# EAGLE design ColorSense (EAGLE 6.2)
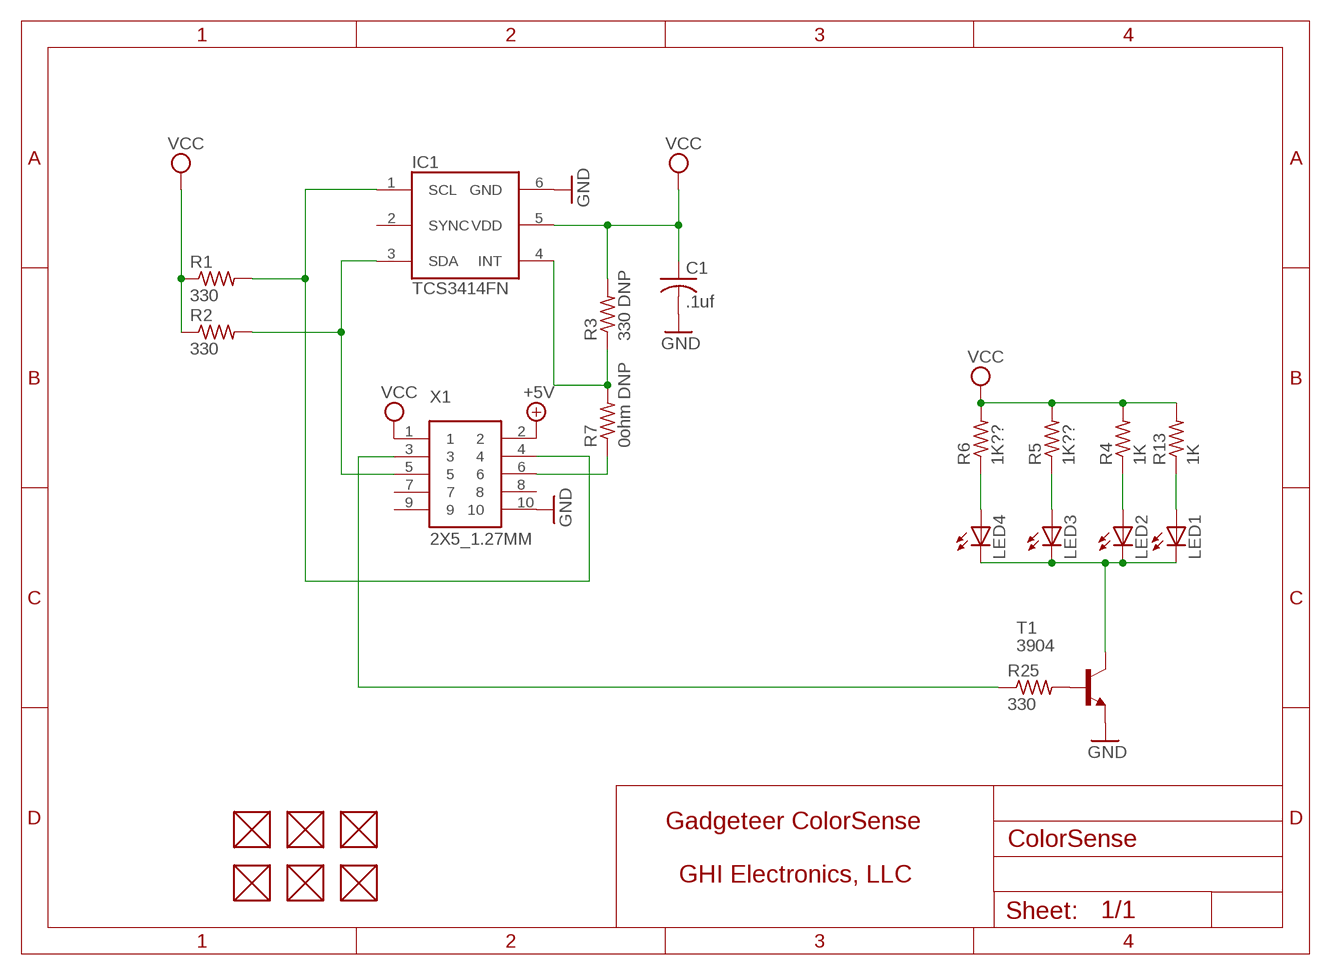
[diagram p0: schematic, sheet 1]

## Parts
C1  .1uf  C-USC0603K  [C0603K]
FUD1  FIDUCIAL  [FIDUCIAL_40MIL]
FUD2  FIDUCIAL  [FIDUCIAL_40MIL]
FUD3  FIDUCIAL  [FIDUCIAL_40MIL]
FUD4  FIDUCIAL  [FIDUCIAL_40MIL]
FUD5  FIDUCIAL  [FIDUCIAL_40MIL]
FUD6  FIDUCIAL  [FIDUCIAL_40MIL]
IC1  TCS3414FN  [DFN-6]
LED1  LEDCHIPLED_0805  [CHIPLED_0805]
LED2  LEDCHIPLED_0805  [CHIPLED_0805]
LED3  LEDCHIPLED_0805  [CHIPLED_0805]
LED4  LEDCHIPLED_0805  [CHIPLED_0805]
R1  330  R-US_R0603  [R0603]
R2  330  R-US_R0603  [R0603]
R3  330 DNP  R-US_R0603  [R0603]
R4  1K  R-US_R0603  [R0603]
R5  1K??  R-US_R0603  [R0603]
R6  1K??  R-US_R0603  [R0603]
R7  0ohm DNP  R-US_R0603  [R0603]
R13  1K  R-US_R0603  [R0603]
R25  330  R-US_R0603  [R0603]
T1  3904  BC847-NPN-SOT23-BEC  [SOT23-BEC]
X1  2X5_1.27MM  [2X5_1.27MM]

## Nets
+5V [power]: X1.2
BACKLIGHT: R25.1 X1.3
GND [power]: C1.2 IC1.6(GND) T1.E X1.10
LED-: LED1.C LED2.C LED3.C LED4.C T1.C
N$1: IC1.4(INT) R3.1 R7.2
N$2: IC1.3(SDA) R2.2 X1.5
N$3: IC1.1(SCL) R1.2 X1.4
N$4: R7.1 X1.6
N$5: LED2.A R4.1
N$6: LED3.A R5.1
N$7: LED4.A R6.1
N$10: LED1.A R13.1
N$23: R25.2 T1.B
VCC [power]: C1.1 IC1.5(VDD) R1.1 R2.1 R3.2 R4.2 R5.2 R6.2 R13.2 X1.1
Unconnected: FUD1.P$1 FUD2.P$1 FUD3.P$1 FUD4.P$1 FUD5.P$1 FUD6.P$1 IC1.2(SYNC) X1.7 X1.8 X1.9

## Notes on the sheet
- Gadgeteer ColorSense
- GHI Electronics, LLC

## Library data of the parts
C1 = rcl:C-US: CAPACITOR, American symbol
FUD1-FUD6 = GHI:FIDUCIAL
IC1 = GHI2:TCS3414FN
LED1-LED4 = led:LED: LED OSRAM: - CHIPLED LG R971, LG N971, LY N971, LG Q971, LY Q971, LO R971, LY R971 LH N974, LH R974 LS Q976, LO Q976, LY Q976 LO Q996 - Hyper CHIPLED LW Q18S LB Q993, LB Q99A, LB R99A - SideLED LS A670, LO A670, LY A670, LG A670, LP A670 LB A673, LV A673, LT A673, LW A673 LH A674 LY A675 LS A676, LA A676, LO A676, LY A676, LW A676 LS A679, LY A679, LG A679 - Hyper Micro SIDELED® LS Y876, LA Y876, LO Y876, LY Y876 LT Y87S - SmartLED LW L88C, LW L88S LB L89C, LB L89S, LG L890 LS L89K, LO L89K, LY L89K LS L896, LA L896, LO L896, LY L896 - TOPLED LS T670, LO T670, LY T670, LG T670, LP T670 LSG T670, LSP T670, LSY T670, LOP T670, LYG T670 LG T671, LOG T671, LSG T671 LB T673, LV T673, LT T673, LW T673 LH T674 LS T676, LA T676, LO T676, LY T676, LB T676, LH T676, LSB T676, LW T676 LB T67C, LV T67C, LT T67C, LS T67K, LO T67K, LY T67K, LW E67C LS E67B, LA E67B, LO E67B, LY E67B, LB E67C, LV E67C, LT E67C LW T67C LS T679, LY T679, LG T679 LS T770, LO T770, LY T770, LG T770, LP T770 LB T773, LV T773, LT T773, LW T773 LH T774 LS E675, LA E675, LY E675, LS T675 LS T776, LA T776, LO T776, LY T776, LB T776 LHGB T686 LT T68C, LB T68C - Hyper Mini TOPLED® LB M676 - Mini TOPLED Santana® LG M470 LS M47K, LO M47K, LY M47K Source: http://www.osram.convergy.de LUXEON: - LUMILED® LXK2-PW12-R00, LXK2-PW12-S00, LXK2-PW14-U00, LXK2-PW14-V00 LXK2-PM12-R00, LXK2-PM12-S00, LXK2-PM14-U00 LXK2-PE12-Q00, LXK2-PE12-R00, LXK2-PE12-S00, LXK2-PE14-T00, LXK2-PE14-U00 LXK2-PB12-K00, LXK2-PB12-L00, LXK2-PB12-M00, LXK2-PB14-N00, LXK2-PB14-P00, LXK2-PB14-Q00 LXK2-PR12-L00, LXK2-PR12-M00, LXK2-PR14-Q00, LXK2-PR14-R00 LXK2-PD12-Q00, LXK2-PD12-R00, LXK2-PD12-S00 LXK2-PH12-R00, LXK2-PH12-S00 LXK2-PL12-P00, LXK2-PL12-Q00, LXK2-PL12-R00 Source: www.luxeon.com KINGBRIGHT: KA-3528ASYC Source: www.kingbright.com
R1-R7 R13 R25 = rcl:R-US_: RESISTOR, American symbol
T1 = transistor:*-NPN-: NPN Transistror BF959 corrected 2008.03.06
X1 = GHI:2X5_1.27MM

## Board
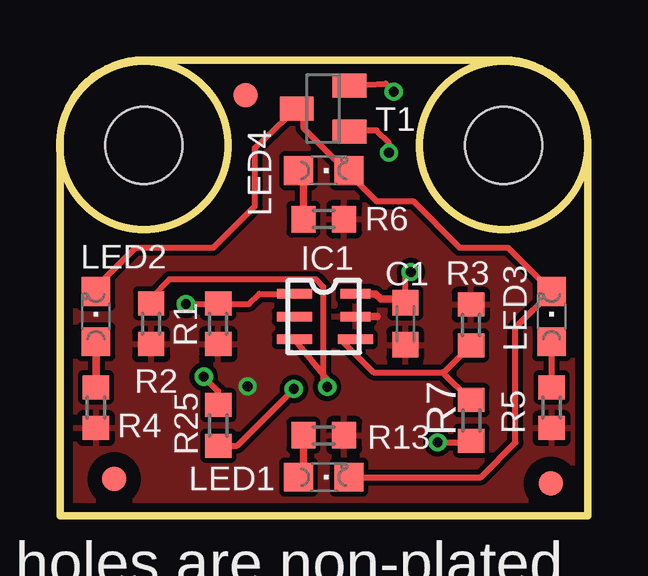
[diagram p1: board, top side]
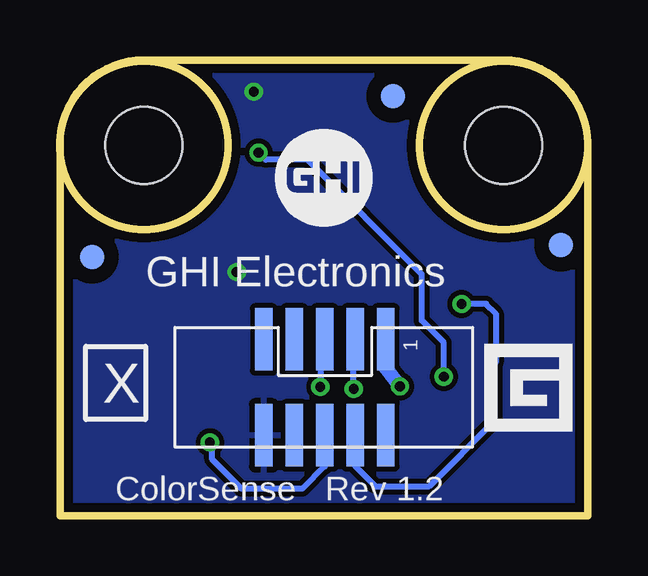
[diagram p2: board, bottom side, seen from below]

Size 22 x 19 mm. Coordinates in mm from the lower left corner, seen from the top.
Outline: 0,0 22,0 22,15.5 arc90 18.5,19 3.5,19 arc90 0,15.5 0,0
Outline: circle at 3.5,15.44 radius 3.5
Outline: circle at 18.5,15.44 radius 3.5
Copper layers (1+16): Top 0.035mm / dielectric 1.5mm / Bottom 0.035mm
Design rules: minimum track width 8mil, minimum drill 12mil, track to track 8mil, track to pad 8mil, pad to pad 8mil, via to via 8mil, smd to smd 8mil, copper to edge 15mil, drill to drill 8mil, minimum pad ring 10mil, minimum via ring 7mil, stop-mask expansion 4mil, vias tented up to drill 50mil, thermal gap 10mil
Holes 3.2 mm at 18.5,15.44 3.5,15.44

### Footprints (pad centres in the part's own frame; a part is rotated, then mirrored left to right if it is on the bottom)
C0603K = smd 1.05 x 1.08: 1 -0.875,0; 2 0.875,0
FIDUCIAL_40MIL = smd 1.016 x 1.016: P$1 0,0
DFN-6 = smd 1.45 x 0.4: 1 -1.225,0.95; 2 -1.225,0; 3 -1.225,-0.95; 4 1.325,-0.95 | smd 1.25 x 0.4: 5 1.325,0; 6 1.325,0.95
CHIPLED_0805 = smd 1.2 x 1.2: A 0,-1.05; C 0,1.05
R0603 = smd 1 x 1.1: 1 -0.85,0; 2 0.85,0
SOT23-BEC = smd 1 x 1.4: B -0.95,-1.1; C 0,1.1; E 0.95,-1.1
2X5_1.27MM = smd 2.6 x 0.74: 1 -2,2.58; 2 2,2.58; 3 -2,1.31; 4 2,1.31; 5 -2,0.04; 6 2,0.04; 7 -2,-1.23; 8 2,-1.23; 9 -2,-2.5; 10 2,-2.5

### Placement (x,y rotation side)
C1  14.4,8 90 top
FUD1  7.74,17.54 0 top
FUD2  2.26,1.52 0 top
FUD3  20.46,1.33 0 top
FUD4  20.66,10.79 0 bottom
FUD5  1.12,11.28 0 bottom
FUD6  8.11,17.49 0 bottom
IC1  11,8.3 0 top
LED1  11,1.6 270 top
LED2  1.5,8.3 0 top
LED3  20.5,8.3 0 top
LED4  11,14.39 270 top
R1  6.6,8 90 top
R2  3.8,8 90 top
R3  17.14,7.95 90 top
R4  1.5,4.5 270 top
R5  20.5,4.5 270 top
R6  11,12.36 0 top
R7  17.15,3.97 90 top
R13  11,3.35 0 top
R25  6.6,3.76 90 top
T1  10.97,16.97 90 top
X1  11,5.35 270 bottom

### Tracks (layer width: path | path; a pad name or v marks a point on that pad's centre or on a via)
BACKLIGHT  (via drill 0.41)
  Top 0.254: R25.1 7.38,2.91 v9.75,5.28
  Bottom 0.254: v9.75,5.28 9.75,7.28 X1.3
GND  (via drill 0.41)
  Top 0.254: C1.2 14.4,9.93 v14.63,10.16 | T1.E 13.58,18.02 v13.92,17.68
  Top 0.305: IC1.6 13.16,9.25 13.38,9.03 14.25,9.03 C1.2
  pour Bottom: 21.95,18.8 21.95,0.1 0,0.1 0,18.8
LED-
  Top 0.254: LED2.C 1.5,9.53 3.15,11.18 6.4,11.18 8.13,12.9 8.13,15.32 T1.C 10.16,16.78 10.16,16.15 11.93,14.39 LED4.C 12.05,14.26 13.21,13.11 14.73,13.11 16.66,11.18 18.67,11.18 LED3.C 19,7.85 19,3.05 17.55,1.6 LED1.C
N$1
  Top 0.254: IC1.4 11.72,7.33 13.07,5.98 15.95,5.98 | 15.95,5.98 16.02,5.98 R3.1 | R7.2 17.11,4.82 15.95,5.98
N$2  (via drill 0.41)
  Top 0.254: IC1.3 11.14,5.68 v11.14,5.37 10.97,5.54 10.97,9.55 10.67,9.86 4.57,9.86 3.8,9.08 R2.2
  Bottom 0.254: X1.5 11.14,7.16 v11.14,5.37
N$3  (via drill 0.41)
  Top 0.254: IC1.1 8.32,9.25 7.89,8.82 6.63,8.82 R1.2 6.57,8.82 v5.25,8.82
  Bottom 0.254: v5.25,8.82 4.24,8.82 3.83,8.42 3.83,6.38 3.86,6.35 3.86,3.96 6.6,1.22 8.84,1.22 9.69,2.07 X1.4 9.69,4.28
N$4  (via drill 0.41)
  Top 0.254: v15.75,3.05 17.08,3.05 R7.1
  Bottom 0.254: X1.6 10.96,2.04 11.89,1.12 14.43,1.12 15.65,2.34 15.65,2.95 v15.75,3.05
N$5
  Top 0.305: LED2.A R4.1
N$6
  Top 0.254: R5.1 LED3.A
N$7
  Top 0.305: R6.1 10.15,14.29 LED4.A
N$10
  Top 0.305: R13.1 10.15,1.7 LED1.A
N$23  (via drill 0.41)
  Top 0.254: R25.2 6.6,5.18 v5.99,5.79 | v13.72,15.14 13.72,15.54 13.21,16.05 12.11,16.05 T1.B
  Bottom 0.254: v5.99,5.79 5.99,7.21 6.91,8.13 6.91,10.06 11.68,14.83 13.41,14.83 v13.72,15.14
VCC  (via drill 0.41)
  Top 0.305: IC1.5 13.22,8.3
  Bottom 0.61: X1.1 8.42,6.18 v7.82,5.38
  pour Top: 21.84,19.1 21.84,0.3 0.51,0.3 0.51,19.1

### Text on the board
tPlace: corner holes are non-plated | Black PCB with white print | Do not add any manufacturing Code!
bPlace: GHI Electronics | X | ColorSense Rev 1.2